# EAGLE schematic PM_proiect (EAGLE 9.6.2)
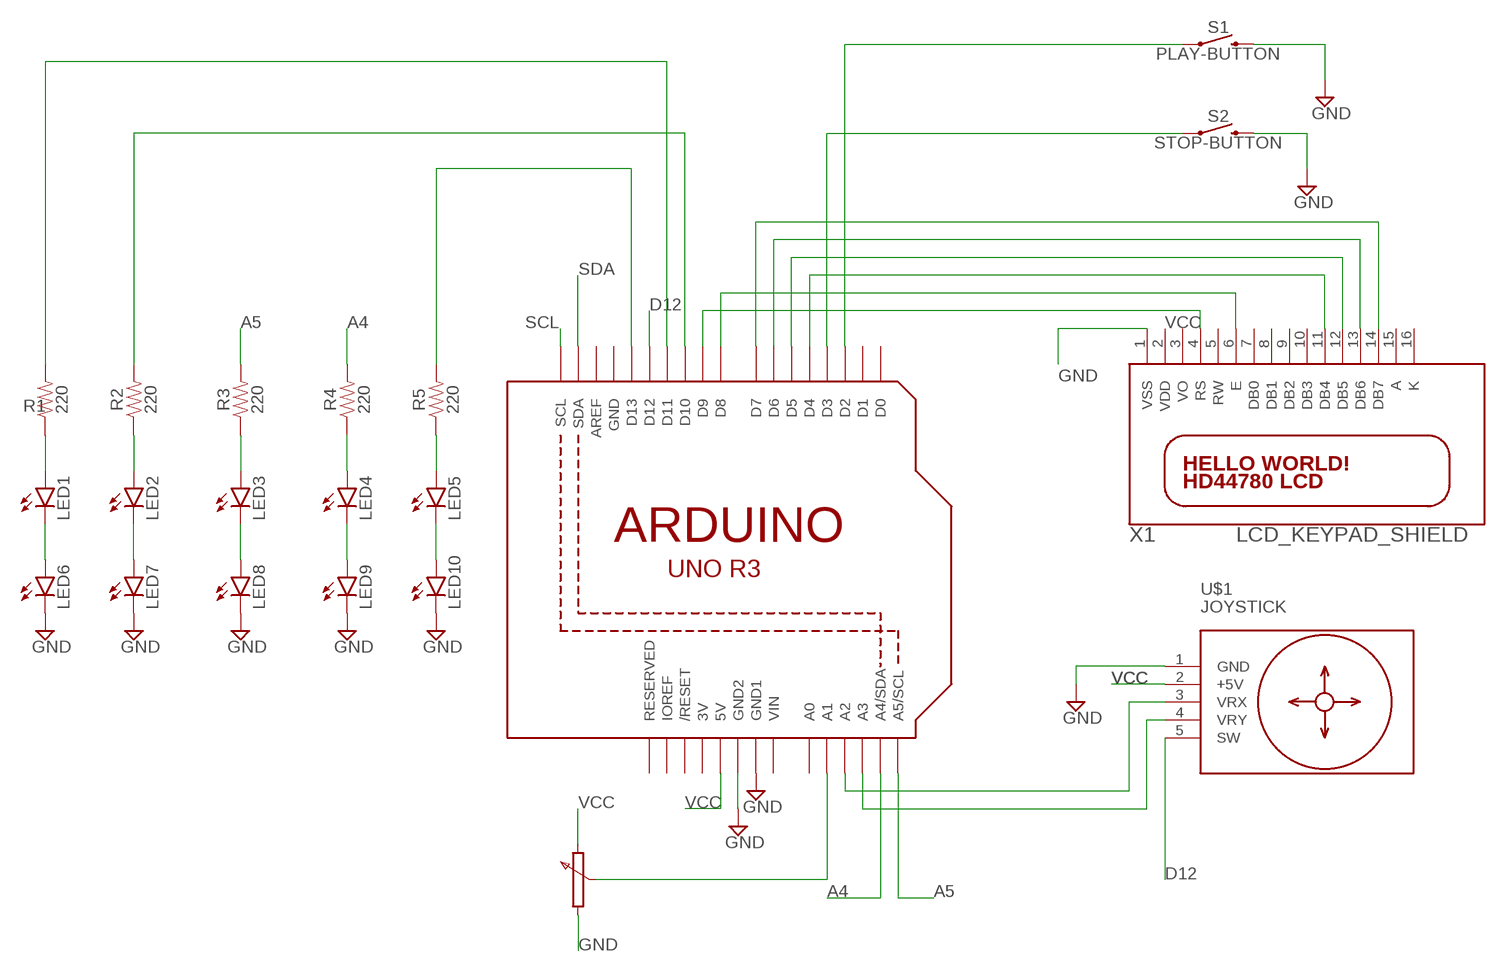
[diagram p0: schematic, sheet 1]

## Parts
LED1  LED5MM  [LED5MM]
LED2  LED5MM  [LED5MM]
LED3  LED5MM  [LED5MM]
LED4  LED5MM  [LED5MM]
LED5  LED5MM  [LED5MM]
LED6  LED5MM  [LED5MM]
LED7  LED5MM  [LED5MM]
LED8  LED5MM  [LED5MM]
LED9  LED5MM  [LED5MM]
LED10  LED5MM  [LED5MM]
R1  220  220OHM-0603-1/10W-1%  [0603]
R2  220  220OHM-0603-1/10W-1%  [0603]
R3  220  220OHM-0603-1/10W-1%  [0603]
R4  220  220OHM-0603-1/10W-1%  [0603]
R5  220  220OHM-0603-1/10W-1%  [0603]
S1  PLAY-BUTTON  MOMENTARY-SWITCH-SPST-PTH-6.0MM  [TACTILE_SWITCH_PTH_6.0MM]
S2  STOP-BUTTON  MOMENTARY-SWITCH-SPST-PTH-6.0MM  [TACTILE_SWITCH_PTH_6.0MM]
U1  ARDUINOR3-DIMENSION  [ARDUINOR3]
U$1  JOYSTICK  JOYSTICK-2AXIS-BUTTON  [JOYSTICK-2AXIS-BUTTON]
X1  LCD_KEYPAD_SHIELD  HD44780LCD-1602  [LCD1602]

## Nets
A4: R4.2 U1.A4(A4/SDA)
A5: R3.2 U1.A5(A5/SCL)
D12: U1.D12 U$1.5(SW)
GND: LED6.K(C) LED7.K(C) LED8.K(C) LED9.K(C) LED10.K(C) S1.3 S2.3 U1.GND1 U1.GND2 U$1.1(GND) X1.1(VSS)
N$1: R5.2 U1.D13
N$2: U1.A2 U$1.3(VRX)
N$3: U1.A3 U$1.4(VRY)
N$4: S2.1 U1.D3
N$5: S1.1 U1.D2
N$6: LED5.A R5.1
N$7: R2.2 U1.D10
N$8: LED4.A R4.1
N$9: R1.2 U1.D11
N$10: LED3.A R3.1
N$11: U1.A1
N$12: LED2.A R2.1
N$13: U1.D7 X1.14(DB7)
N$14: LED1.A R1.1
N$15: LED1.K(C) LED6.A
N$16: LED2.K(C) LED7.A
N$17: LED3.K(C) LED8.A
N$18: LED4.K(C) LED9.A
N$19: LED5.K(C) LED10.A
N$20: U1.D6 X1.13(DB6)
N$21: U1.D5 X1.12(DB5)
N$22: U1.D4 X1.11(DB4)
N$23: U1.D8 X1.6(E)
SCL: U1.SCL
SDA: U1.SDA
VCC: U1.5V U1.D9 U$1.2(+5V) X1.4(RS)
Unconnected: U1.A0 U1.AREF U1.D0 U1.D1 U1.IOREF U1.RESERVED U1.RESET(/RESET) X1.2(VDD) X1.3(VO) X1.5(RW) X1.7(DB0) X1.8(DB1) X1.9(DB2) X1.10(DB3) X1.15(A) X1.16(K)

## Power pins joined to a net without a drawn wire
3V: U1.3V
GND: U1.GND
VIN: U1.VIN

## Library data of the parts
LED1-LED10 = led:LED: LED OSRAM: - CHIPLED LG R971, LG N971, LY N971, LG Q971, LY Q971, LO R971, LY R971 LH N974, LH R974 LS Q976, LO Q976, LY Q976 LO Q996 - Hyper CHIPLED LW Q18S LB Q993, LB Q99A, LB R99A - SideLED LS A670, LO A670, LY A670, LG A670, LP A670 LB A673, LV A673, LT A673, LW A673 LH A674 LY A675 LS A676, LA A676, LO A676, LY A676, LW A676 LS A679, LY A679, LG A679 - Hyper Micro SIDELED® LS Y876, LA Y876, LO Y876, LY Y876 LT Y87S - SmartLED LW L88C, LW L88S LB L89C, LB L89S, LG L890 LS L89K, LO L89K, LY L89K LS L896, LA L896, LO L896, LY L896 - TOPLED LS T670, LO T670, LY T670, LG T670, LP T670 LSG T670, LSP T670, LSY T670, LOP T670, LYG T670 LG T671, LOG T671, LSG T671 LB T673, LV T673, LT T673, LW T673 LH T674 LS T676, LA T676, LO T676, LY T676, LB T676, LH T676, LSB T676, LW T676 LB T67C, LV T67C, LT T67C, LS T67K, LO T67K, LY T67K, LW E67C LS E67B, LA E67B, LO E67B, LY E67B, LB E67C, LV E67C, LT E67C LW T67C LS T679, LY T679, LG T679 LS T770, LO T770, LY T770, LG T770, LP T770 LB T773, LV T773, LT T773, LW T773 LH T774 LS E675, LA E675, LY E675, LS T675 LS T776, LA T776, LO T776, LY T776, LB T776 LHGB T686 LT T68C, LB T68C - Hyper Mini TOPLED® LB M676 - Mini TOPLED Santana® LG M470 LS M47K, LO M47K, LY M47K Source: http://www.osram.convergy.de LUXEON: - LUMILED® LXK2-PW12-R00, LXK2-PW12-S00, LXK2-PW14-U00, LXK2-PW14-V00 LXK2-PM12-R00, LXK2-PM12-S00, LXK2-PM14-U00 LXK2-PE12-Q00, LXK2-PE12-R00, LXK2-PE12-S00, LXK2-PE14-T00, LXK2-PE14-U00 LXK2-PB12-K00, LXK2-PB12-L00, LXK2-PB12-M00, LXK2-PB14-N00, LXK2-PB14-P00, LXK2-PB14-Q00 LXK2-PR12-L00, LXK2-PR12-M00, LXK2-PR14-Q00, LXK2-PR14-R00 LXK2-PD12-Q00, LXK2-PD12-R00, LXK2-PD12-S00 LXK2-PH12-R00, LXK2-PH12-S00 LXK2-PL12-P00, LXK2-PL12-Q00, LXK2-PL12-R00 Source: www.luxeon.com KINGBRIGHT: KA-3528ASYC Source: www.kingbright.com
R1-R5 = SparkFun-Resistors:220OHM: 220Ω resistor A resistor is a passive two-terminal electrical component that implements electrical resistance as a circuit element. Resistors act to reduce current flow, and, at the same time, act to lower voltage levels within circuits. - Wikipedia; PROD_ID: RES-07861
S1 S2 = SparkFun-Switches:MOMENTARY-SWITCH-SPST: Momentary Switch (Pushbutton) - SPST Normally-open (NO) SPST momentary switches (buttons, pushbuttons). Variants PTH-12MM - 12mm square, through-hole Momentary Pushbutton Switch - 12mm Square <https://www.sparkfun.com/products/9190> (COM-09190) PTH-6.0MM, PTH-6.0MM-KIT - 6.0mm square, through-hole Mini Pushbutton Switch <https://www.sparkfun.com/products/97> (COM-00097) KIT package intended for soldering kit's - only one side of pads' copper is exposed. PTH-RIGHT-ANGLE-KIT - Right-angle, through-hole Right Angle Tactile Button <https://www.sparkfun.com/products/10791> - Used on SparkFun BigTime Watch Kit <https://www.sparkfun.com/products/11734> SMD-12MM - 12mm square, surface-mount Tactile Button - SMD (12mm) <https://www.sparkfun.com/products/12993> (COM-12993) Used on SparkFun PicoBoard <https://www.sparkfun.com/products/11888> SMD-4.5MM - 4.5mm Square Trackball Switch Used on SparkFun Blackberry Trackballer Breakout <https://www.sparkfun.com/products/13169> SMD-4.6MMX2.8MM - 4.60mm x 2.80mm, surface mount Used on SparkFun Pro Micro - RP2040 <https://www.sparkfun.com/products/17717> SMD-5.2MM, SMD-5.2-REDUNDANT - 5.2mm square, surface-mount Mini Pushbutton Switch - SMD <https://www.sparkfun.com/products/8720> (COM-08720) Used on Arduino Pro Mini <https://www.sparkfun.com/products/11114> REDUNDANT package connects both switch circuits together SMD-6.0X3.5MM - 6.0 x 3.5mm, surface mount Momentary Reset Switch SMD <https://www.sparkfun.com/products/8229> (COM-08229) SMD-6.2MM-TALL - 6.2mm square, surface mount Tactile Button - SMD (6mm) <https://www.sparkfun.com/products/12992> Used on SparkFun Digital Sandbox <https://www.sparkfun.com/products/12651> SMD-RIGHT-ANGLE - Right-angle, surface mount Used on SparkFun Block for Intel® Edison - Arduino <https://www.sparkfun.com/products/13036>; PROD_ID: SWCH-08441; SF_SKU: COM-00097
U1 = adafruit:ARDUINOR3: This is a new object for the new Arduino R3 - with extra pins that you may want to use (such as IOref, and duplicated A4/A5
U$1 = diy-modules:JOYSTICK-2AXIS-BUTTON: 2-Axis Analog Joystick with Push Button Tutorial is available here: http://henrysbench.capnfatz.com/henrys-bench/arduino-sensors-and-input/arduino-ps2-joystick-tutorial-keyes-ky-023-deek-robot/ Click here to find device on ebay.com <http://www.ebay.com/sch/joystick+ps2+module>
X1 = adafruit:HD44780LCD: HD44780 LCD Standard character type LCDs, available in sizes from 8x1 to 40x4!